# Altium schematic sheet PineconePiWatch-Top.SchDoc
size A2
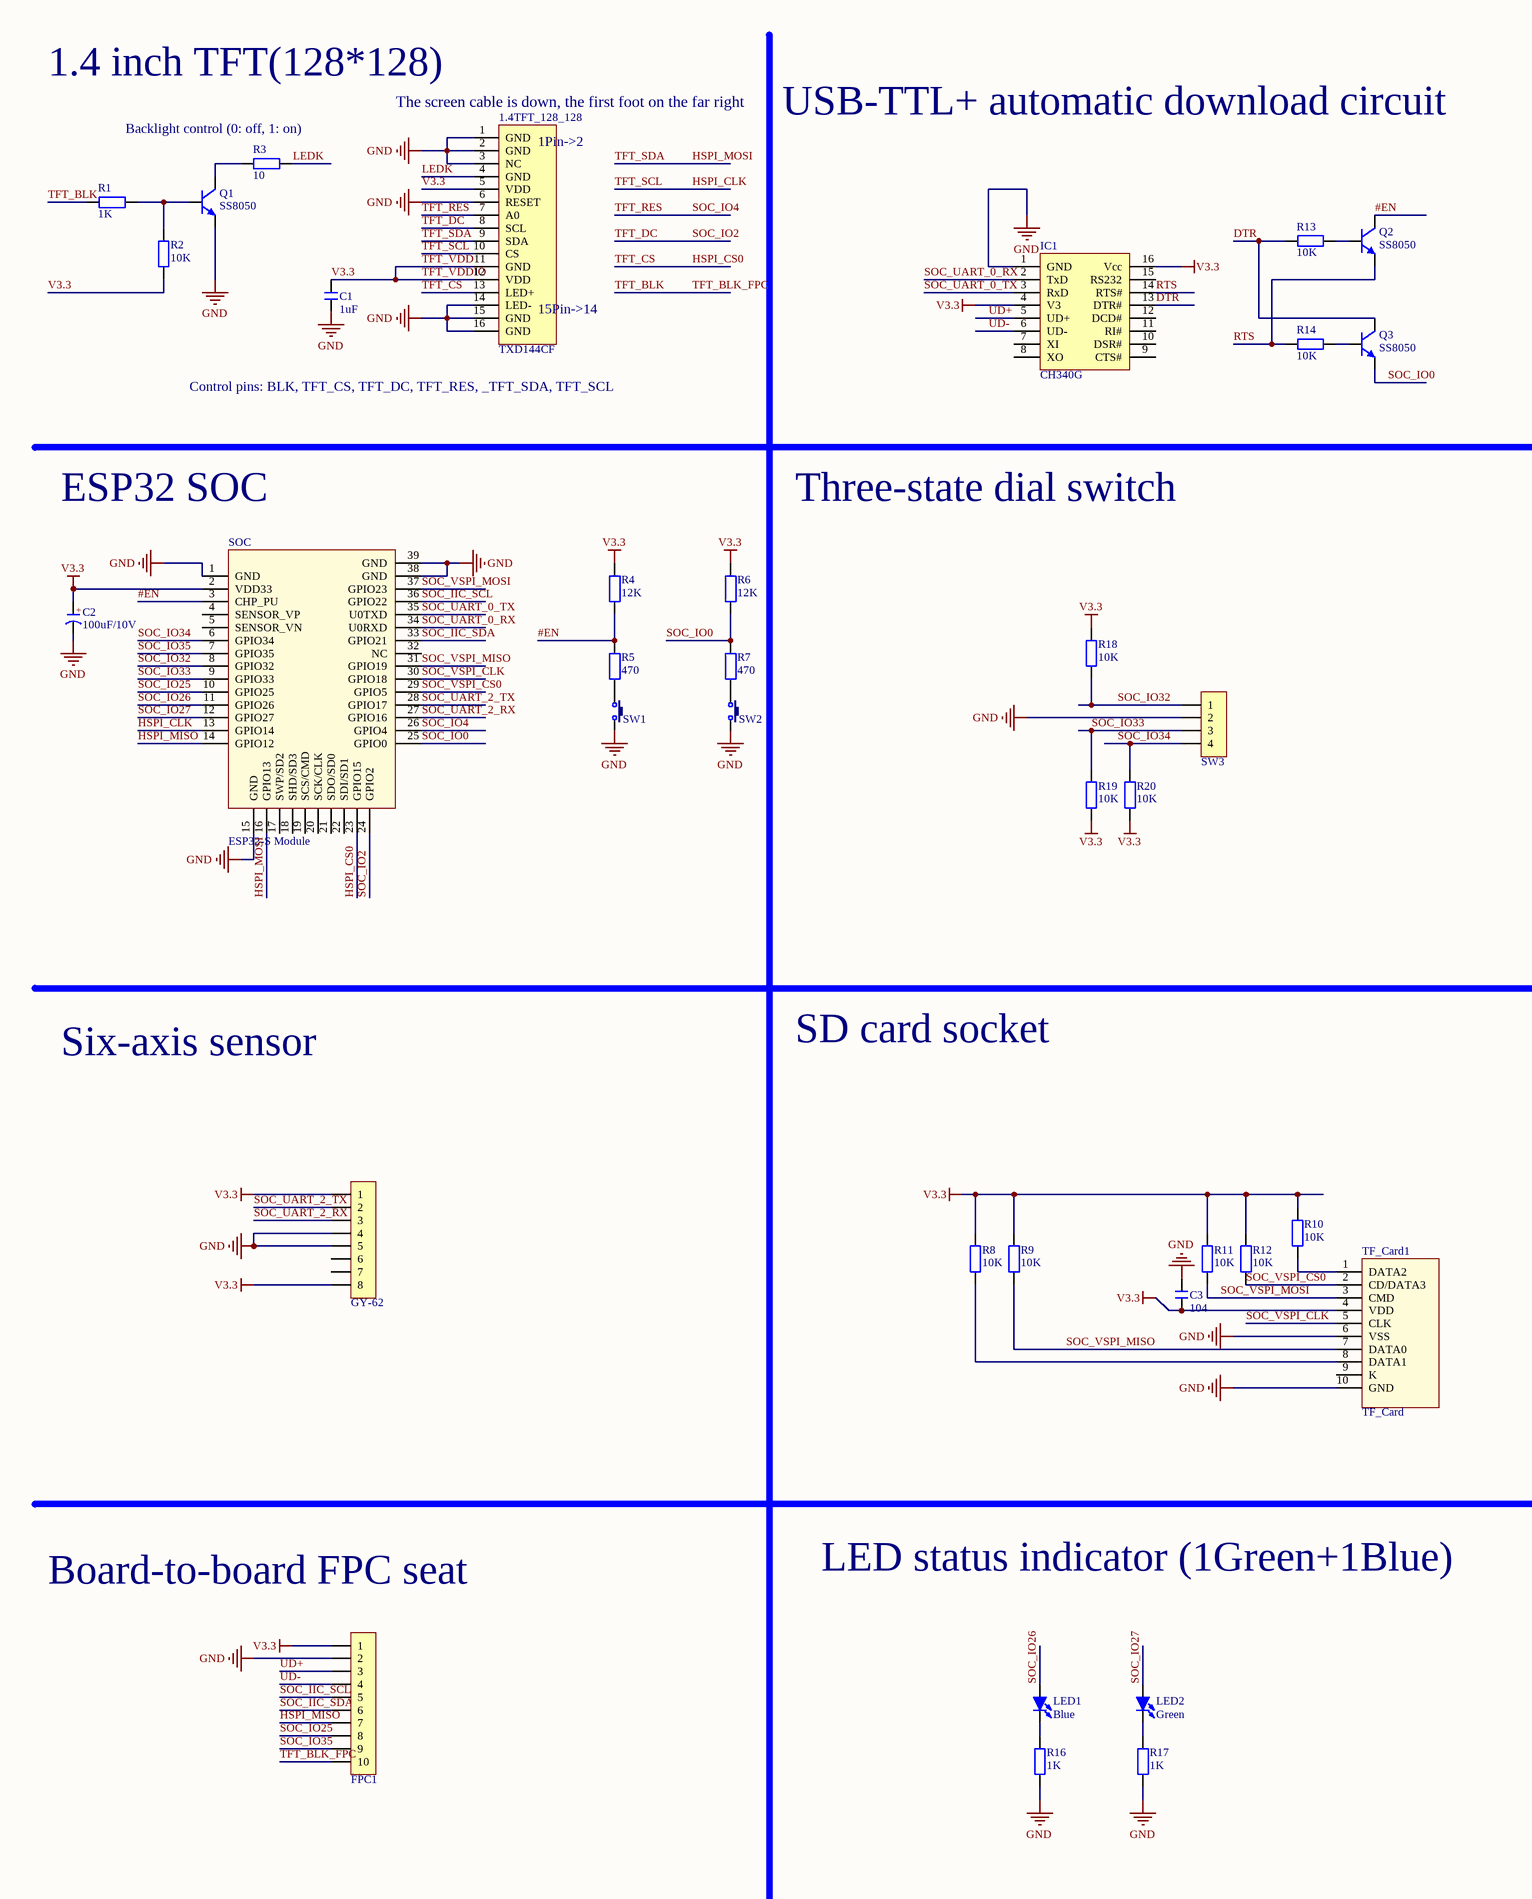
[diagram p0: PineconePiWatch-Top.SchDoc, left]
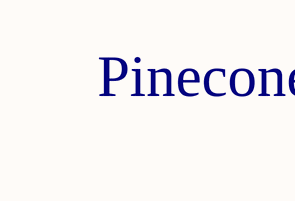
[diagram p1: PineconePiWatch-Top.SchDoc, right]

## Parts
1.4TFT_128_128  TXD144CF  [TXD144CF]
C1  1uF  [C 0603_L]
C2  100uF/10V  [CD C(6032)]
C3  104  [C 0603_L]
FPC1  HDR-1X10  [FPC1.0-2H-WS-10P]  (value not drawn)
GY-62  HDR-1X8  [维特智能GY61/62]  (value not drawn)
IC1  CH340G  [SOP16_L]
LED1  Blue  [LED 0603B]
LED2  Green  [LED 0603G]
Q1  SS8050  [SOT-23]
Q2  SS8050  [SOT-23]
Q3  SS8050  [SOT-23]
R1  1K  [R 0603_L]
R2  10K  [R 0603_L]
R3  10  [R 0603_L]
R4  12K  [R 0603_L]
R5  470  [R 0603_L]
R6  12K  [R 0603_L]
R7  470  [R 0603_L]
R8  10K  [R 0603_L]
R9  10K  [R 0603_L]
R10  10K  [R 0603_L]
R11  10K  [R 0603_L]
R12  10K  [R 0603_L]
R13  10K  [R 0603_L]
R14  10K  [R 0603_L]
R16  1K  [R 0603_L]
R17  1K  [R 0603_L]
R18  10K  [R 0603_L]
R19  10K  [R 0603_L]
R20  10K  [R 0603_L]
SOC  ESP32-S Module  [PCBComponent_1]
SW1  3x6x5  [TSW SMD-3*6*2.5]  (value not drawn)
SW2  3x6x5  [TSW SMD-3*6*2.5]  (value not drawn)
SW3  HDR-1X4  [4Pin三段拨动开关]  (value not drawn)
TF_Card1  TF_Card  [SDCARD-M]

## Nets
GND: 1.4TFT_128_128.1(GND) 1.4TFT_128_128.2(GND) 1.4TFT_128_128.3(NC) 1.4TFT_128_128.6(RESET) 1.4TFT_128_128.14(LED-) 1.4TFT_128_128.15(GND) 1.4TFT_128_128.16(GND) C1.1 C2.2(K) C3.2 FPC1.2 GY-62.4 GY-62.5 IC1.1(GND) Q1.2(E) R16.1 R17.1 SOC.1(GND) SOC.15(GND) SOC.38(GND) SOC.39(GND) SW1.2 SW2.2 SW3.2 TF_Card1.6(VSS) TF_Card1.10(GND)
TFT_VDD: 1.4TFT_128_128.5(VDD) 1.4TFT_128_128.11(GND) 1.4TFT_128_128.12(VDD) C1.2 C2.1(A) C3.1 FPC1.1 GY-62.1 GY-62.8 IC1.4(V3) IC1.16(Vcc) R2.1 R4.2 R6.2 R8.2 R9.2 R10.2 R11.2 R12.2 R18.2 R19.1 R20.1 SOC.2(VDD33) TF_Card1.4(VDD)  [also labelled TFT_VDDIO, V3.3]
#EN: Q2.3(C) R4.1 R5.2 SOC.3(CHP_PU)
DTR: IC1.13(DTR#) Q3.3(C) R13.2
HSPI_CLK: 1.4TFT_128_128.10(CS) SOC.13(GPIO14)  [also labelled TFT_SCL]
HSPI_CS0: 1.4TFT_128_128.13(LED+) SOC.23(GPIO15)  [also labelled TFT_CS]
HSPI_MISO: FPC1.7 SOC.14(GPIO12)
HSPI_MOSI: 1.4TFT_128_128.9(SDA) SOC.16(GPIO13)  [also labelled TFT_SDA]
LEDK: 1.4TFT_128_128.4(GND) R3.1
RTS: IC1.14(RTS#) Q2.2(E) R14.1
SOC_IIC_SCL: FPC1.5 SOC.36(GPIO22)
SOC_IIC_SDA: FPC1.6 SOC.33(GPIO21)
SOC_IO0: Q3.2(E) R6.1 R7.2 SOC.25(GPIO0)
SOC_IO2: 1.4TFT_128_128.8(SCL) SOC.24(GPIO2)  [also labelled TFT_DC]
SOC_IO4: 1.4TFT_128_128.7(A0) SOC.26(GPIO4)  [also labelled TFT_RES]
SOC_IO25: FPC1.8 SOC.10(GPIO25)
SOC_IO26: LED1.1(A) SOC.11(GPIO26)
SOC_IO27: LED2.1(A) SOC.12(GPIO27)
SOC_IO32: R18.1 SOC.8(GPIO32) SW3.1
SOC_IO33: R19.2 SOC.9(GPIO33) SW3.3
SOC_IO34: R20.2 SOC.6(GPIO34) SW3.4
SOC_IO35: FPC1.9 SOC.7(GPIO35)
SOC_UART_0_RX: IC1.2(TxD) SOC.34(U0RXD)
SOC_UART_0_TX: IC1.3(RxD) SOC.35(U0TXD)
SOC_UART_2_RX: GY-62.3 SOC.27(GPIO16)
SOC_UART_2_TX: GY-62.2 SOC.28(GPIO17)
SOC_VSPI_CLK: SOC.30(GPIO18) TF_Card1.5(CLK)
SOC_VSPI_CS0: R12.1 SOC.29(GPIO5) TF_Card1.2(CD/DATA3)
SOC_VSPI_MISO: R9.1 SOC.31(GPIO19) TF_Card1.7(DATA0)
SOC_VSPI_MOSI: R11.1 SOC.37(GPIO23) TF_Card1.3(CMD)
TFT_BLK: FPC1.10 R1.1  [also labelled TFT_BLK_FPC]
UD+: FPC1.3 IC1.5(UD+)
UD-: FPC1.4 IC1.6(UD-)
NetLED1_2: LED1.2(K) R16.2
NetLED2_2: LED2.2(K) R17.2
NetQ1_1: Q1.1(B) R1.2 R2.2
NetQ1_3: Q1.3(C) R3.2
NetQ2_1: Q2.1(B) R13.1
NetQ3_1: Q3.1(B) R14.2
NetR5_1: R5.1 SW1.1
NetR7_1: R7.1 SW2.1
NetR8_1: R8.1 TF_Card1.8(DATA1)
NetR10_1: R10.1 TF_Card1.1(DATA2)

Not connected (* = marked no-connect by the designer): GY-62 6 7; IC1 7(XI) 8(XO) 9(CTS#) 10(DSR#) 11(RI#) 12(DCD#) 15(RS232); SOC 4(SENSOR_VP) 5(SENSOR_VN) 17(SWP/SD2) 18(SHD/SD3) 19(SCS/CMD) 20(SCK/CLK) 21(SDO/SD0) 22(SDI/SD1) 32(NC); TF_Card1 9(K)

## Notes on the sheet
- 1.4 inch TFT(128*128)
- (near 1.4TFT_128_128) The screen cable is down, the first foot on the far right
- (near R3) Backlight control (0: off, 1: on)
- (near 1.4TFT_128_128) 1Pin->2
- USB-TTL+ automatic download circuit
- (near 1.4TFT_128_128) 15Pin->14
- (near 1.4TFT_128_128) Control pins: BLK, TFT_CS, TFT_DC, TFT_RES, _TFT_SDA, TFT_SCL
- ESP32 SOC
- Three-state dial switch
- Six-axis sensor
- SD card socket
- Board-to-board FPC seat
- LED status indicator (1Green+1Blue)
- PineconePiWatch
- Title
- Size:
- Date:
- File:
- A2
- Number:
- Time:
- Revision:
- Sheet
- of
- (in symbol CE_SMD) +

## Library data of the parts
1.4TFT_128_128 = TXD144CF: 1.44寸TFT; BOM名称: 1.44寸TFT屏; 版权归属: 封装库来自淘宝 ID：黄晶宝石; 唯一出售店铺网址: https://shop463601444.taobao.com
C1 C3 = C: 贴片电容; BOM名称: 无极性贴片电容; 淘宝ID: 封装库来自淘宝 ID：黄晶宝石; 联系售后，技术支持: https://shop463601444.taobao.com; 唯一出售店铺网址: https://shop463601444.taobao.com
C2 = CE_SMD: 贴片电解电容; 版权归属: 封装库来自淘宝 ID：黄晶宝石; BOM名称: 贴片电解电容; 联系售后: https://shop463601444.taobao.com
FPC1 = Header 10: 10P接插件; 版权归属: 封装库来自淘宝 ID：黄晶宝石; BOM名称: 10P接插件; 学习资源: https://shop463601444.taobao.com
GY-62 = Header 8: 8P接插件; 版权归属: 封装库来自淘宝 ID：黄晶宝石; BOM名称: 8P接插件; 学习资源: https://shop463601444.taobao.com
IC1 = CH340G: 串口转USB; 版权归属: 封装库来自淘宝 ID：黄晶宝石; BOM名称: 串口转USB; 学习资源: https://shop463601444.taobao.com
LED1 LED2 = LED-SMD: 贴片LED; 版权归属: 封装库来自淘宝 ID：黄晶宝石; BOM名称: 贴片LED; 学习资源: https://shop463601444.taobao.com
Q1-Q3 = 8050-SMD: 高频放大-NPN型; 版权归属: 封装库来自淘宝 ID：黄晶宝石; 属性: 40V 1.5A 1W 100MHZ; BOM名称: 高频放大-NPN型; 联系售后: https://shop463601444.taobao.com
R1-R14 R16-R20 = R: 贴片电阻; 版权归属: 来自淘宝 ID：黄晶宝石; 封装库来自淘宝卖家 ID：黄晶宝石: 其他店铺购入均为盗版，不享受售后技术支持服务，请立即申请退款; BOM名称: 贴片电阻; 联系售后: https://shop463601444.taobao.com
SW1 SW2 = TSW 3x6: 3x6轻触开关; 版权归属: 封装库来自淘宝 ID：黄晶宝石; BOM名称: 3x6轻触开关; 学习资源: https://shop463601444.taobao.com
SW3 = Header 4: 4P接插件; 版权归属: 封装库来自淘宝 ID：黄晶宝石; BOM名称: 4P接插件; 学习资源: https://shop463601444.taobao.com
TF_Card1 = TF_Card: TF卡座; BOM名称: TF卡座; 学习资源: https://shop463601444.taobao.com